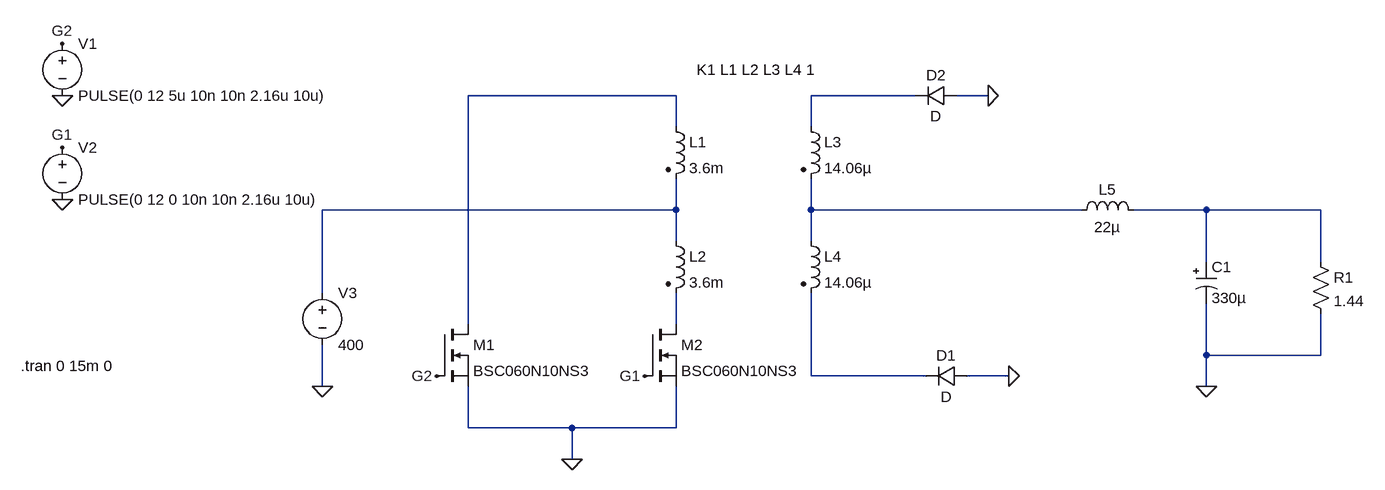
[diagram p0: schematic Open_loop_trial_for_400Vin.asc]
Open_loop_trial_for_400Vin.asc, the LTspice schematic file:
Version 4
SHEET 1 2016 1428
WIRE 784 -128 464 -128
WIRE 1152 -128 992 -128
WIRE 1264 -128 1216 -128
WIRE 784 -80 784 -128
WIRE 992 -80 992 -128
WIRE 784 48 784 0
WIRE 784 48 240 48
WIRE 992 48 992 0
WIRE 1408 48 992 48
WIRE 1600 48 1488 48
WIRE 1776 48 1600 48
WIRE 784 96 784 48
WIRE 992 96 992 48
WIRE 1600 128 1600 48
WIRE 1776 128 1776 48
WIRE 240 176 240 48
WIRE 464 224 464 -128
WIRE 784 224 784 176
WIRE 1600 272 1600 192
WIRE 1776 272 1776 208
WIRE 1776 272 1600 272
WIRE 992 304 992 176
WIRE 1168 304 992 304
WIRE 1296 304 1232 304
WIRE 240 320 240 256
WIRE 1600 320 1600 272
WIRE 464 384 464 320
WIRE 624 384 464 384
WIRE 784 384 784 320
WIRE 784 384 624 384
WIRE 624 432 624 384
FLAG 1600 320 0
FLAG 736 304 G1
FLAG 416 304 G2
FLAG 240 320 0
FLAG 624 432 0
FLAG -160 32 0
FLAG -160 -128 0
FLAG -160 -48 G1
FLAG -160 -208 G2
FLAG 1264 -128 0
FLAG 1296 304 0
SYMBOL nmos 416 224 R0
SYMATTR InstName M1
SYMATTR Value BSC060N10NS3
SYMBOL nmos 736 224 R0
SYMATTR InstName M2
SYMATTR Value BSC060N10NS3
SYMBOL voltage 240 160 R0
WINDOW 123 0 0 Left 0
WINDOW 39 0 0 Left 0
SYMATTR InstName V3
SYMATTR Value 400
SYMBOL ind2 768 -96 R0
SYMATTR InstName L1
SYMATTR Value 3.6m
SYMATTR Type ind
SYMBOL ind2 768 80 R0
SYMATTR InstName L2
SYMATTR Value 3.6m
SYMATTR Type ind
SYMBOL ind2 976 -96 R0
SYMATTR InstName L3
SYMATTR Value 14.06µ
SYMATTR Type ind
SYMBOL ind2 976 80 R0
SYMATTR InstName L4
SYMATTR Value 14.06µ
SYMATTR Type ind
SYMBOL ind 1392 64 R270
WINDOW 0 32 56 VTop 2
WINDOW 3 5 56 VBottom 2
SYMATTR InstName L5
SYMATTR Value 22µ
SYMBOL polcap 1584 128 R0
WINDOW 3 24 56 Left 2
SYMATTR Value 330µ
SYMATTR InstName C1
SYMATTR Description Capacitor
SYMATTR Type cap
SYMATTR SpiceLine V=100 Irms=720m Rser=0.09 Lser=0 mfg="Nichicon" pn="UPR2A331MRH" type="Al electrolytic"
SYMBOL res 1760 112 R0
SYMATTR InstName R1
SYMATTR Value 1.44
SYMBOL voltage -160 -224 R0
WINDOW 123 0 0 Left 0
WINDOW 39 0 0 Left 0
SYMATTR InstName V1
SYMATTR Value PULSE(0 12 5u 10n 10n 2.16u 10u)
SYMBOL voltage -160 -64 R0
WINDOW 123 0 0 Left 0
WINDOW 39 0 0 Left 0
SYMATTR InstName V2
SYMATTR Value PULSE(0 12 0 10n 10n 2.16u 10u)
SYMBOL diode 1232 288 R90
WINDOW 0 0 32 VBottom 2
WINDOW 3 32 32 VTop 2
SYMATTR InstName D1
SYMBOL diode 1216 -144 R90
WINDOW 0 0 32 VBottom 2
WINDOW 3 32 32 VTop 2
SYMATTR InstName D2
TEXT 816 -168 Left 2 !K1 L1 L2 L3 L4 1
TEXT -224 288 Left 2 !.tran 0 15m 0

The netlist it stands for:
* Open_loop_trial_for_400Vin.asc
M1 N001 G2 0 0 BSC060N10NS3
M2 N006 G1 0 0 BSC060N10NS3
V3 N003 0 400
L1 N001 N003 3.6m
L2 N003 N006 3.6m
L3 N002 N004 14.06µ
L4 N004 N007 14.06µ
L5 N004 N005 22µ
C1 N005 0 330µ V=100 Irms=720m Rser=0.09 Lser=0 mfg="Nichicon" pn="UPR2A331MRH" type="Al electrolytic"
R1 N005 0 1.44
V1 G2 0 PULSE(0 12 5u 10n 10n 2.16u 10u)
V2 G1 0 PULSE(0 12 0 10n 10n 2.16u 10u)
D1 0 N007 D
D2 0 N002 D
.model D D
.lib standard.dio
.model NMOS NMOS
.model PMOS PMOS
.lib standard.mos
K1 L1 L2 L3 L4 1
.tran 0 15m 0
.backanno
.end